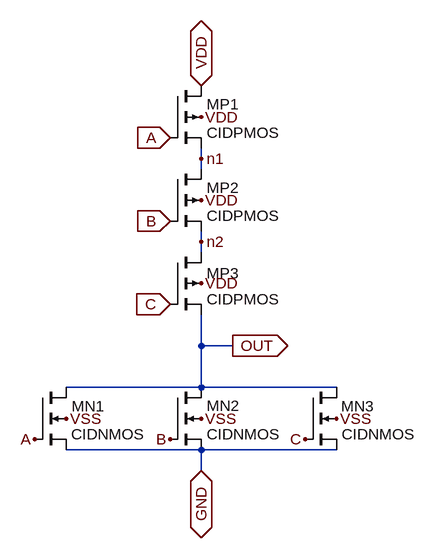
[diagram p0: schematic NOR3X1_sch.asc]
NOR3X1_sch.asc, the LTspice schematic file:
Version 4.1
SHEET 1 880 764
WIRE 208 128 208 112
WIRE 208 144 208 128
WIRE 208 256 208 240
WIRE 208 272 208 256
WIRE 208 416 208 368
WIRE 256 416 208 416
WIRE 208 480 208 416
WIRE 208 480 0 480
WIRE 416 480 208 480
WIRE 208 576 0 576
WIRE 416 576 208 576
WIRE 208 608 208 576
FLAG 160 96 A
IOPIN 160 96 In
FLAG 160 224 B
IOPIN 160 224 In
FLAG 160 352 C
IOPIN 160 352 In
FLAG 208 16 VDD
IOPIN 208 16 BiDir
FLAG 256 416 OUT
IOPIN 256 416 Out
FLAG 208 608 GND
IOPIN 208 608 BiDir
FLAG -48 560 A
FLAG 160 560 B
FLAG 368 560 C
FLAG 208 320 VDD
FLAG 208 192 VDD
FLAG 208 64 VDD
FLAG 0 528 VSS
FLAG 208 528 VSS
FLAG 416 528 VSS
FLAG 208 128 n1
FLAG 208 256 n2
SYMBOL pmos4 160 16 R0
WINDOW 0 56 28 Left 2
SYMATTR InstName MP1
SYMATTR Value CIDPMOS
SYMATTR Value2 l=5u w=37.5u
SYMBOL pmos4 160 144 R0
WINDOW 0 56 29 Left 2
SYMATTR InstName MP2
SYMATTR Value CIDPMOS
SYMATTR Value2 l=5u w=37.5u
SYMBOL pmos4 160 272 R0
SYMATTR InstName MP3
SYMATTR Value CIDPMOS
SYMATTR Value2 l=5u w=37.5u
SYMBOL nmos4 -48 480 R0
WINDOW 0 57 29 Left 2
SYMATTR InstName MN1
SYMATTR Value CIDNMOS
SYMATTR Value2 l=5u w=10u
SYMBOL nmos4 160 480 R0
WINDOW 0 56 28 Left 2
SYMATTR InstName MN2
SYMATTR Value CIDNMOS
SYMATTR Value2 l=5u w=10u
SYMBOL nmos4 368 480 R0
WINDOW 0 55 29 Left 2
SYMATTR InstName MN3
SYMATTR Value CIDNMOS
SYMATTR Value2 l=5u w=10u

The netlist it stands for:
* NOR3X1_sch.asc
MP1 VDD A n1 VDD CIDPMOS l=5u w=37.5u
MP2 n1 B n2 VDD CIDPMOS l=5u w=37.5u
MP3 n2 C OUT VDD CIDPMOS l=5u w=37.5u
MN1 OUT A GND VSS CIDNMOS l=5u w=10u
MN2 OUT B GND VSS CIDNMOS l=5u w=10u
MN3 OUT C GND VSS CIDNMOS l=5u w=10u
.model NMOS NMOS
.model PMOS PMOS
.lib standard.mos
.backanno
.end